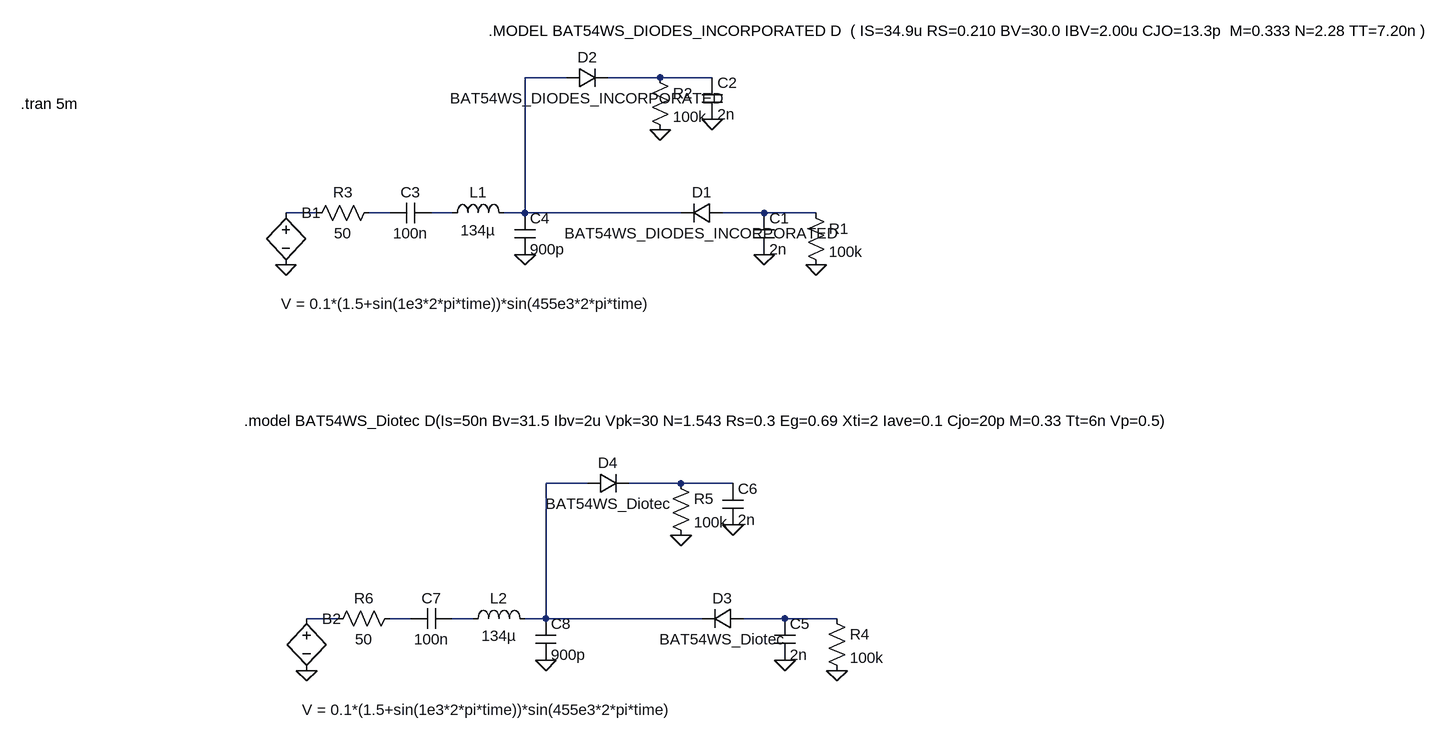
[diagram p0: schematic Improved_455Khz_envelope_detector.asc]
Improved_455Khz_envelope_detector.asc, the LTspice schematic file:
Version 4
SHEET 1 2200 1132
WIRE 128 144 64 144
WIRE 272 144 192 144
WIRE 352 144 272 144
WIRE -256 352 -304 352
WIRE -144 352 -176 352
WIRE -48 352 -80 352
WIRE 64 352 64 144
WIRE 64 352 32 352
WIRE 304 352 64 352
WIRE 432 352 368 352
WIRE 512 352 432 352
WIRE 160 768 96 768
WIRE 304 768 224 768
WIRE 384 768 304 768
WIRE -224 976 -272 976
WIRE -112 976 -144 976
WIRE -16 976 -48 976
WIRE 96 976 96 768
WIRE 96 976 64 976
WIRE 336 976 96 976
WIRE 464 976 400 976
WIRE 544 976 464 976
FLAG 432 416 0
FLAG 512 432 0
FLAG -304 432 0
FLAG 272 224 0
FLAG 352 208 0
FLAG 64 416 0
FLAG 464 1040 0
FLAG 544 1056 0
FLAG -272 1056 0
FLAG 304 848 0
FLAG 384 832 0
FLAG 96 1040 0
SYMBOL diode 368 336 R90
WINDOW 0 0 32 VBottom 2
WINDOW 3 32 32 VTop 2
SYMATTR InstName D1
SYMATTR Value BAT54WS_DIODES_INCORPORATED
SYMBOL cap 416 352 R0
SYMATTR InstName C1
SYMATTR Value 2n
SYMBOL res 496 336 R0
SYMATTR InstName R1
SYMATTR Value 100k
SYMBOL diode 128 160 R270
WINDOW 0 32 32 VTop 2
WINDOW 3 0 32 VBottom 2
SYMATTR InstName D2
SYMATTR Value BAT54WS_DIODES_INCORPORATED
SYMBOL res 256 128 R0
SYMATTR InstName R2
SYMATTR Value 100k
SYMBOL cap 336 144 R0
SYMATTR InstName C2
SYMATTR Value 2n
SYMBOL bv -304 336 R0
WINDOW 3 -7 156 Left 2
SYMATTR InstName B1
SYMATTR Value V = 0.1*(1.5+sin(1e3*2*pi*time))*sin(455e3*2*pi*time)
SYMBOL cap -80 336 R90
WINDOW 0 0 32 VBottom 2
WINDOW 3 32 32 VTop 2
SYMATTR InstName C3
SYMATTR Value 100n
SYMBOL ind -64 368 R270
WINDOW 0 32 56 VTop 2
WINDOW 3 5 56 VBottom 2
SYMATTR InstName L1
SYMATTR Value 134µ
SYMBOL res -160 336 R90
WINDOW 0 0 56 VBottom 2
WINDOW 3 32 56 VTop 2
SYMATTR InstName R3
SYMATTR Value 50
SYMBOL cap 48 352 R0
SYMATTR InstName C4
SYMATTR Value 900p
SYMBOL diode 400 960 R90
WINDOW 0 0 32 VBottom 2
WINDOW 3 32 32 VTop 2
SYMATTR InstName D3
SYMATTR Value BAT54WS_Diotec
SYMBOL cap 448 976 R0
SYMATTR InstName C5
SYMATTR Value 2n
SYMBOL res 528 960 R0
SYMATTR InstName R4
SYMATTR Value 100k
SYMBOL diode 160 784 R270
WINDOW 0 32 32 VTop 2
WINDOW 3 0 32 VBottom 2
SYMATTR InstName D4
SYMATTR Value BAT54WS_Diotec
SYMBOL res 288 752 R0
SYMATTR InstName R5
SYMATTR Value 100k
SYMBOL cap 368 768 R0
SYMATTR InstName C6
SYMATTR Value 2n
SYMBOL bv -272 960 R0
WINDOW 3 -7 156 Left 2
SYMATTR InstName B2
SYMATTR Value V = 0.1*(1.5+sin(1e3*2*pi*time))*sin(455e3*2*pi*time)
SYMBOL cap -48 960 R90
WINDOW 0 0 32 VBottom 2
WINDOW 3 32 32 VTop 2
SYMATTR InstName C7
SYMATTR Value 100n
SYMBOL ind -32 992 R270
WINDOW 0 32 56 VTop 2
WINDOW 3 5 56 VBottom 2
SYMATTR InstName L2
SYMATTR Value 134µ
SYMBOL res -128 960 R90
WINDOW 0 0 56 VBottom 2
WINDOW 3 32 56 VTop 2
SYMATTR InstName R6
SYMATTR Value 50
SYMBOL cap 80 976 R0
SYMATTR InstName C8
SYMATTR Value 900p
TEXT 8 72 Left 2 !.MODEL BAT54WS_DIODES_INCORPORATED D  ( IS=34.9u RS=0.210 BV=30.0 IBV=2.00u CJO=13.3p  M=0.333 N=2.28 TT=7.20n )
TEXT -712 184 Left 2 !.tran 5m
TEXT -368 672 Left 2 !.model BAT54WS_Diotec D(Is=50n Bv=31.5 Ibv=2u Vpk=30 N=1.543 Rs=0.3 Eg=0.69 Xti=2 Iave=0.1 Cjo=20p M=0.33 Tt=6n Vp=0.5)

The netlist it stands for:
* Improved_455Khz_envelope_detector.asc
D1 N006 N001 BAT54WS_DIODES_INCORPORATED
C1 N006 0 2n
R1 N006 0 100k
D2 N001 N002 BAT54WS_DIODES_INCORPORATED
R2 N002 0 100k
C2 N002 0 2n
B1 N003 0 V = 0.1*(1.5+sin(1e3*2*pi*time))*sin(455e3*2*pi*time)
C3 N005 N004 100n
L1 N005 N001 134µ
R3 N004 N003 50
C4 N001 0 900p
D3 N012 N007 BAT54WS_Diotec
C5 N012 0 2n
R4 N012 0 100k
D4 N007 N008 BAT54WS_Diotec
R5 N008 0 100k
C6 N008 0 2n
B2 N009 0 V = 0.1*(1.5+sin(1e3*2*pi*time))*sin(455e3*2*pi*time)
C7 N011 N010 100n
L2 N011 N007 134µ
R6 N010 N009 50
C8 N007 0 900p
.model D D
.lib standard.dio
.MODEL BAT54WS_DIODES_INCORPORATED D  ( IS=34.9u RS=0.210 BV=30.0 IBV=2.00u CJO=13.3p  M=0.333 N=2.28 TT=7.20n )
.tran 5m
.model BAT54WS_Diotec D(Is=50n Bv=31.5 Ibv=2u Vpk=30 N=1.543 Rs=0.3 Eg=0.69 Xti=2 Iave=0.1 Cjo=20p M=0.33 Tt=6n Vp=0.5)
.backanno
.end